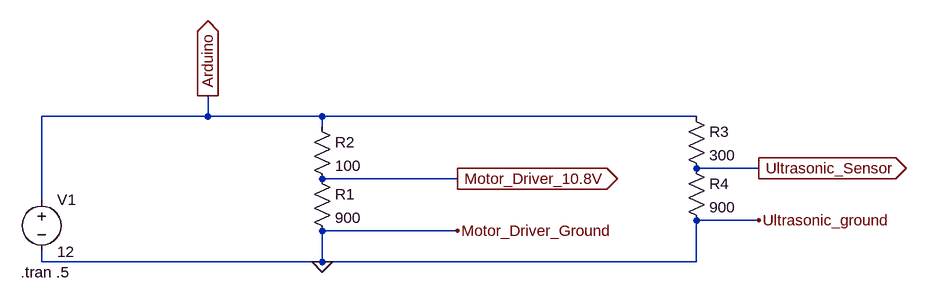
[diagram p0: schematic VoltageDivider.asc]
VoltageDivider.asc, the LTspice schematic file:
Version 4
SHEET 1 1360 680
WIRE 240 0 240 -32
WIRE 240 0 -16 0
WIRE 416 0 240 0
WIRE 992 0 416 0
WIRE 416 16 416 0
WIRE 1088 80 992 80
WIRE 624 96 416 96
WIRE -16 128 -16 0
WIRE 1088 160 992 160
WIRE 624 176 416 176
WIRE -16 224 -16 208
WIRE 416 224 416 176
WIRE 416 224 -16 224
WIRE 992 224 992 160
WIRE 992 224 416 224
FLAG 240 -32 Arduino
IOPIN 240 -32 Out
FLAG 624 96 Motor_Driver_10.8V
IOPIN 624 96 Out
FLAG 624 176 Motor_Driver_Ground
FLAG 1088 80 Ultrasonic_Sensor
IOPIN 1088 80 Out
FLAG 1088 160 Ultrasonic_ground
FLAG 416 224 0
SYMBOL voltage -16 112 R0
WINDOW 123 0 0 Left 0
WINDOW 39 0 0 Left 0
SYMATTR InstName V1
SYMATTR Value 12
SYMBOL res 400 80 R0
SYMATTR InstName R1
SYMATTR Value 900
SYMBOL res 400 0 R0
SYMATTR InstName R2
SYMATTR Value 100
SYMBOL res 976 -16 R0
SYMATTR InstName R3
SYMATTR Value 300
SYMBOL res 976 64 R0
SYMATTR InstName R4
SYMATTR Value 900
TEXT -48 240 Left 2 !.tran .5

The netlist it stands for:
* VoltageDivider.asc
V1 Arduino 0 12
R1 Motor_Driver_10.8V 0 900
R2 Arduino Motor_Driver_10.8V 100
R3 Arduino Ultrasonic_Sensor 300
R4 Ultrasonic_Sensor 0 900
.tran .5
.backanno
.end